# Altium project Sensor Board.PrjPcb
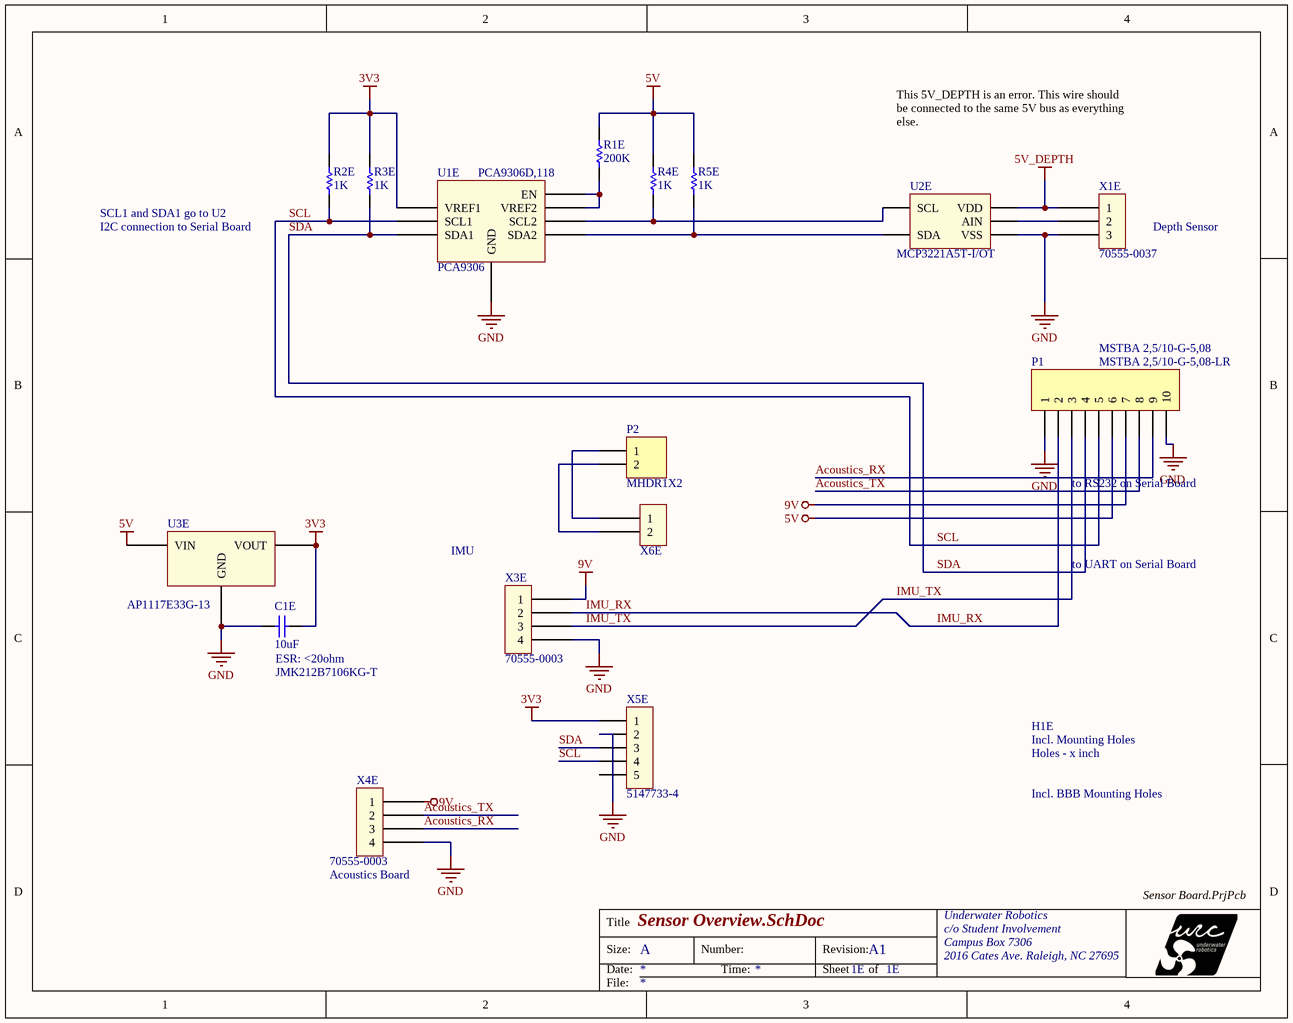
[diagram p0: Sensor Overview.SchDoc]
1 sheet, 18 parts. Net scope: global (net labels, ports and power ports of the same name join across sheets).
Board file: Sensor Board.PcbDoc

## Sheet Sensor Overview.SchDoc
size A; Organization: Underwater Robotics; Address1: c/o Student Involvement; Address2: Campus Box 7306; Address3: 2016 Cates Ave. Raleigh, NC 27695; Revision: A1; SheetNumber: 1E; SheetTotal: 1E

### Parts
C1E  value 10uF  ESR: <20ohm  Manufacturer Part Number: JMK212B7106KG-T  [C0805]  (hidden comment: .1uF)
H1E  Holes - x inch  [110mil Holes - 1.0 Inch]
H2E  BBB Hole Pattern  [BBB Hole Pattern]  (value not drawn)
P1  MSTBA 2,5/10-G-5,08  Manufacturer Part Number: MSTBA 2,5/10-G-5,08-LR  [MSTBA 2,5/10-G-5,08]
P2  MHDR1X2  [MHDR1X2]
R1E  value 200K  [R0603]  (hidden comment: Resistor)
R2E  value 1K  [R0603]  (hidden comment: Resistor)
R3E  value 1K  [R0603]  (hidden comment: Resistor)
R4E  value 1K  [R0603]  (hidden comment: Resistor)
R5E  value 1K  [R0603]  (hidden comment: Resistor)
U1E  PCA9306  Manufacturer Part Number: PCA9306D,118  [PCA9306-SO8]
U2E  Manufacturer Part Number: MCP3221A5T-I/OT  [MCP3221-SOT23-5]
U3E  AP1117E33G-13  [AP1117]
X1E  70555-0037  [70555-0037]
X3E  70555-0003  [70555-0003]
X4E  70555-0003  [70555-0003]
X5E  Manufacturer Part Number: 5147733-4  [SMD Female Header, 5147733-4 w/ header]  (hidden comment: Header)
X6E  Header  [1x2 Header]  (value not drawn)

### Nets
3V3: C1E.1 R2E.2 R3E.2 U1E.VREF1 U3E.VOUT X5E.1
5V: P1.6 R1E.2 R4E.2 R5E.2 U3E.VIN
5V_DEPTH: U2E.VDD X1E.1
9V: P1.7 X3E.1 X4E.1
GND: C1E.2 P1.1 P1.10 U1E.GND U2E.VSS U3E.GND X1E.3 X3E.4 X4E.4 X5E.2
Acoustics_RX: P1.9 X4E.3
Acoustics_TX: P1.8 X4E.2
IMU_RX: P1.2 X3E.2
IMU_TX: P1.3 X3E.3
SCL: P1.5 R2E.1 U1E.SCL1 X5E.4
SDA: P1.4 R3E.1 U1E.SDA1 X5E.3
NetP2_1: P2.1 X6E.1
NetP2_2: P2.2 X6E.2
NetR1E_1: R1E.1 U1E.EN U1E.VREF2
NetR4E_1: R4E.1 U1E.SCL2 U2E.SCL
NetR5E_1: R5E.1 U1E.SDA2 U2E.SDA
NetU2E_AIN: U2E.AIN X1E.2

Not connected (* = marked no-connect by the designer): X5E 5

### Notes on the sheet
- This 5V_DEPTH is an error. This wire should be connected to the same 5V bus as everything else.
- SCL1 and SDA1 go to U2
- I2C connection to Serial Board
- Depth Sensor
- to RS232 on Serial Board
- IMU
- to UART on Serial Board
- (near X4E) Acoustics Board
- Title
- Size:
- Date:
- A
- Number:
- Time:
- Revision:
- Sheet
- of
- File:
- (in symbol BBB Hole Pattern) Incl. BBB Mounting Holes
- (in symbol Holes - x inch) Incl. Mounting Holes

### Library data of the parts
C1E = Cap: Unpolarized Capacitor; Manufacturer 1: TAIYO YUDEN; Description 1: TAIYO YUDEN - JMK212B7106KG-T - CERAMIC CAPACITOR, 10UF, 6.3V, X7R, 10%, 0805; Product Range: M Series; Capacitance: 10 F; Capacitance Tolerance: 10%; Dielectric Characteristic: X7; Voltage Rating: 6.3; Ceramic Capacitor Case: 0805 [2012 Metric]; Supplier 1: Newark; Supplier Part Number 1: 84R9126; RoHS: YES; Stock 1: 492; Pricing 1: 1=0.13, 10=0.12, 50=0.112, 100=0.105, 500=0.083, 1000=0.068 (USD); Packaging: Cut Tape; ComponentLink1URL: http://www.farnell.com/datasheets/1910934.pdf; ComponentLink1Description: http://www.farnell.com/datasheets/1910934.pdf
P1 = MSTBA 2,5/10-G-5,08: Header, 10-Pin; Manufacturer 1: PHOENIX CONTACT; Description 1: PHOENIX CONTACT - MSTBA 2,5/10-G-5,08-LR - TERMINAL BLOCK, HEADER, 10POS, TH; URL: http://www.mouser.com/ProductDetail/Phoenix-Contact/1792708/?qs=sGAEpiMZZMsDddcp1dBDJI66tvLKBAoKnRJwuCPjeJk%3d; Supplier 1: Newark; Supplier Part Number 1: 88W5041; RoHS: YES; Stock 1: 37; Pricing 1: 1=3.07, 100=2.89, 250=2.67, 500=2.55, 1000=2.27 (USD); ComponentLink1URL: http://www.farnell.com/datasheets/1702208.pdf; ComponentLink1Description: http://www.farnell.com/datasheets/1702208.pdf
P2 = MHDR1X2: Header, 2-Pin; LatestRevisionDate: 17-Jul-2002; LatestRevisionNote: Re-released for DXP Platform.; Publisher: Altium Limited
R1E = 200K, 5%, 100mW, Yageo, R0603: Manufacturer 1: YAGEO; Manufacturer Part Number: RC0603JR-07200KL; Tolerance: 5%; Description 1: YAGEO - RC0603JR-07200KL - RES, THICK FILM, 200K, 5%, 0.1W, 0603; Product Range: RC Series; Resistance: 200; Power Rating: 100; Voltage Rating: 50; Resistor Case Style: 0603 [1608 Metric]; No. of Pins: 2; Supplier 1: Newark; Supplier Part Number 1: 68R0165; RoHS: YESX; Stock 1: 7315; Pricing 1: 1=0.07, 10=0.012, 25=0.008, 100=0.005, 250=0.004, 1000=0.002 (USD); Resistance Tolerance: 5%; Packaging: Cut Tape; MSL: -; ComponentLink1URL: http://past.yageo.com/pdf/PYu-R_Packing_6.pdf; ComponentLink1Description: http://past.yageo.com/pdf/PYu-R_Packing_6.pdf; ComponentLink2URL: http://www.farnell.com/cad/1538908.zip; ComponentLink2Description: http://www.farnell.com/cad/1538908.zip; ComponentLink3URL: http://www.farnell.com/datasheets/1868787.pdf; ComponentLink3Description: http://www.farnell.com/datasheets/1868787.pdf; ComponentLink4URL: http://www.yageo.com/pdf/PYu-RC0603_51_RoHS_L_4.pdf; ComponentLink4Description: http://www.yageo.com/pdf/PYu-RC0603_51_RoHS_L_4.pdf
R2E R3E R4E R5E = 1k, 5%, 100mW, Yageo, R0603: Manufacturer 1: YAGEO; Manufacturer Part Number: RC0603JR-131KL; Tolerance: 5%; Description 1: YAGEO - RC0603JR-131KL - RES, THICK FILM, 1K, 5%, 0.1W, 0603; Product Range: RC Series; Resistance: 1; Power Rating: 100; Voltage Rating: 50; Resistor Case Style: 0603 [1608 Metric]; Body Height: 0.45; Supplier 1: Newark; Supplier Part Number 1: 68R0220; RoHS: YESX; Stock 1: 36430; Pricing 1: 1=0.06, 10=0.011, 25=0.008, 100=0.005, 250=0.003, 1000=0.002 (USD); Resistance Tolerance: 5%; Packaging: Cut Tape; MSL: -; ComponentLink1URL: http://www.farnell.com/datasheets/1868787.pdf; ComponentLink1Description: http://www.farnell.com/datasheets/1868787.pdf; ComponentLink2URL: http://www.yageo.com/pdf/PYu-RC0603_51_RoHS_L_4.pdf; ComponentLink2Description: http://www.yageo.com/pdf/PYu-RC0603_51_RoHS_L_4.pdf
U1E = PCA9306: PCA9306, Bidirectional level translator; Manufacturer: NXP; IC Interface Type: I2; Supply Voltage Min: 1; Supply Voltage Max: 3.6; Interface Case Style: SOIC; No. of Pins: 8; Supplier 1: Newark; Supplier Part Number 1: 70R6428; RoHS: YES; Stock 1: 3293; Pricing 1: 1=0.346, 10=0.346, 25=0.346, 100=0.346, 250=0.317, 500=0.317, 1000=0.293, 2500=0.272 (USD); Interface Applications: -; Operating Temperature Min: -40 C; Packaging: Cut Tape; ComponentLink1URL: http://www.nxp.com/packings/SOT96-1_118.html; ComponentLink1Description: http://www.nxp.com/packings/SOT96-1_118.html; ComponentLink2URL: http://www.farnell.com/cad/1549203.zip; ComponentLink2Description: http://www.farnell.com/cad/1549203.zip; ComponentLink3URL: http://www.farnell.com/datasheets/1805226.pdf; ComponentLink3Description: http://www.farnell.com/datasheets/1805226.pdf
U2E = MCP3221: MCP3221, 12 bit ADC, I2C; Manufacturer: MICROCHIP; Resolution (Bits): 12; Sampling Rate: 22.3; Supply Voltage Type: Single; Supply Voltage Min: 2.7; Supply Voltage Max: 5.5; ADC / DAC Case Style: SOT-23; No. of Pins: 5; Supplier 1: Newark; Supplier Part Number 1: 92C2410; RoHS: YES; Stock 1: 2165; Pricing 1: 1=1.44, 26=1.2, 100=1.09 (USD); ComponentLink1URL: http://www.farnell.com/cad/1545531.zip; ComponentLink1Description: http://www.farnell.com/cad/1545531.zip; ComponentLink2URL: http://www.farnell.com/datasheets/12186.pdf; ComponentLink2Description: http://www.farnell.com/datasheets/12186.pdf
U3E = AP1117E33G-13: 3.3V 1A Linear Regulator; Supplier 1: Newark; Supplier Part Number 1: 79R5845
X1E = 70555-0037: Molex, C-Grid SL 70555, 3 Pin; Product Range: SL 70555 Series; Contact Termination Type: Through Hole; Gender: Header; No. of Contacts: 3; Pitch Spacing: 2.54; No. of Rows: 1; Supplier 1: Newark; Supplier Part Number 1: 59H2958; Manufacturer: MOLEX; RoHS: YES; Stock 1: 1580; Pricing 1: 1=0.679, 10=0.622, 100=0.575, 500=0.575, 1000=0.534, 2000=0.495, 5000=0.484, 10000=0.47 (USD); Contact Plating: Gold Plated Contacts; ComponentLink1URL: http://www.farnell.com/cad/1737917.pdf; ComponentLink1Description: http://www.farnell.com/cad/1737917.pdf; ComponentLink2URL: http://www.farnell.com/datasheets/1947503.pdf; ComponentLink2Description: http://www.farnell.com/datasheets/1947503.pdf; ComponentLink3URL: http://www.farnell.com/cad/1980011.zip; ComponentLink3Description: http://www.farnell.com/cad/1980011.zip
X3E X4E = 70555-0003: Molex, C-Grid SL 70555, 4 Pin; Product Range: SL 70555 Series; Contact Termination Type: Through Hole; Gender: Header; No. of Contacts: 4; Pitch Spacing: 2.54; No. of Rows: 1; Supplier 1: Newark; Supplier Part Number 1: 56R5848; Manufacturer: MOLEX; RoHS: YES; Stock 1: 324; Pricing 1: 1=0.77, 10=0.706, 100=0.651, 500=0.651, 1000=0.605, 2000=0.549, 5000=0.529 (USD); Contact Plating: Tin Plated Contacts; ComponentLink1URL: http://www.molex.com/pdm_docs/sd/705550042_sd.pdf; ComponentLink1Description: http://www.molex.com/pdm_docs/sd/705550042_sd.pdf; ComponentLink2URL: http://www.farnell.com/cad/1737917.pdf; ComponentLink2Description: http://www.farnell.com/cad/1737917.pdf; ComponentLink3URL: http://www.farnell.com/cad/1981959.zip; ComponentLink3Description: http://www.farnell.com/cad/1981959.zip
X5E = 1x5 Header, Female, TE Connectivity: 1x5 Header; Description 1: Headers & Wire Housings 05 MODII HORZ SR SFMNT SN; Current Rating: 2 A; Mounting Angle: Right; Number of Positions: 5 Position; Brand: TE Connectivity / AMP; Pitch: 2.54 mm; Supplier 1: Mouser; Supplier Part Number 1: 571-5147733-4; Manufacturer 1: TE Connectivity; RoHS: RoHS Compliant; Category: Headers & Wire Housings; Stock 1: 4960; Pricing 1: 1=0.656, 25=0.621, 50=0.570, 100=0.538, 500=0.512, 1000=0.512 (AUD); Contact Plating: Tin; Housing Material: Polycyclohexylenedimethylene Terephthalate (PCT); Number of Rows: 1 Row; Operating Temperature Range: - 55 C to + 125 C; Packaging: Reel; Product: Headers; Series: AMPMODU MOD II; Termination Style: SMD; Type: Socket Assembly; Contact Material: Phosphor Bronze; Mounting Style: -; Standard Pack Qty: 1000; Tradename: AMPMODU; RoHS - Mouser: Y; Minimum Order Quantity: 1; Reeling: True; ComponentLink1URL: http://www.mouser.com/ds/2/418/NG_CD_5147733_A6-627319.pdf; ComponentLink1Description: http://www.mouser.com/ds/2/418/NG_CD_5147733_A6-627319.pdf
X6E = 1x2 Header